# Altium project Control_Board_Model_C204.PrjPcb (part 2 of 2)

## Sheet Analog_Signal_Conditioner_V2.SchDoc: Analog Signal Conditioner
size A4; DocumentNumber: 6; SheetNumber: 6; SheetTotal: 51
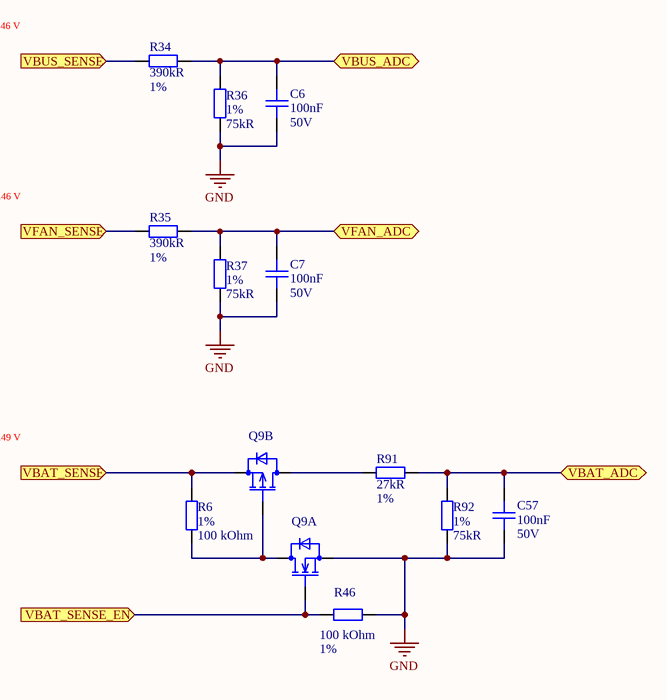
[diagram p5: Analog_Signal_Conditioner_V2.SchDoc]

### Parts
C6  Capacitance: 100nF  Voltage: 50V  [C0402]  (hidden comment: CAP CER 0.1UF 50V X7R 0402)
C7  Capacitance: 100nF  Voltage: 50V  [C0402]  (hidden comment: CAP CER 0.1UF 50V X7R 0402)
C57  Capacitance: 100nF  Voltage: 50V  [C0402]  (hidden comment: CAP CER 0.1UF 50V X7R 0402)
Q9  EM6M2T2R  [SON_400UV-7_DIO]  (value not drawn)  (parts A,B of 2)
R6  Tolerance: 1%  Resistance: 100 kOhm  [R0402]  (hidden comment: RES SMD 100K OHM 1% 1/16W 0402)
R34  Resistance: 390kR  Tolerance: 1%  [R0402]  (hidden comment: RES SMD 390K OHM 1% 1/16W 0402)
R35  Resistance: 390kR  Tolerance: 1%  [R0402]  (hidden comment: RES SMD 390K OHM 1% 1/16W 0402)
R36  Tolerance: 1%  Resistance: 75kR  [R0402]  (hidden comment: RES SMD 75K OHM 1% 1/16W 0402)
R37  Tolerance: 1%  Resistance: 75kR  [R0402]  (hidden comment: RES SMD 75K OHM 1% 1/16W 0402)
R46  Tolerance: 1%  Resistance: 100 kOhm  [R0402]  (hidden comment: RES SMD 100K OHM 1% 1/16W 0402)
R91  Resistance: 27kR  Tolerance: 1%  [R0402]  (hidden comment: RES SMD 27K OHM 1% 1/16W 0402)
R92  Tolerance: 1%  Resistance: 75kR  [R0402]  (hidden comment: RES SMD 75K OHM 1% 1/16W 0402)

### Ports
VBAT_ADC (bidir), VBAT_SENSE (in), VBAT_SENSE_EN (in), VBUS_ADC (bidir), VBUS_SENSE (in), VFAN_ADC (bidir), VFAN_SENSE (in)

### Nets
GND: C6.1 C7.1 C57.1 Q9.1(S) R36.1 R37.1 R46.1 R92.1
NetC6_2: C6.2 R34.2 R36.2 ; port VBUS_ADC
NetC7_2: C7.2 R35.2 R37.2 ; port VFAN_ADC
NetC57_2: C57.2 R91.2 R92.2 ; port VBAT_ADC
NetQ9_2: Q9.2(G) R46.2 ; port VBAT_SENSE_EN
NetQ9_3: Q9.3(D) R91.1
NetQ9_4: Q9.4(S) R6.2 ; port VBAT_SENSE
NetQ9_5: Q9.5(G) Q9.6(D) R6.1
NetR34_1: R34.1 ; port VBUS_SENSE
NetR35_1: R35.1 ; port VFAN_SENSE

### Notes on the sheet
- (near R34) VBUS_SENSE max = 20.46 V
- (near R35) VFAN_SENSE max = 20.46 V
- VBAT_SENSE max = 4.49 V
- Title
- Size:
- Date:
- A4
- Number:
- Time:
- Revision:
- Sheet
- of
- File:

### Library data of the parts
C6 C7 C57 = CAP CER 0.1UF 50V X7R 0402: 0.1µF ±10% 50V Ceramic Capacitor X7R 0402 (1005 Metric); Manufacturer Part Number: CGA2B3X7R1H104K050BB; Manufacturer: TDK; Supplier 1: Digi-Key; Stock 1: 2925303; Pricing 1: 1=0.17, 10=0.118, 50=0.0668, 100=0.0553, 500=0.0388, 1000=0.0321, 2500=0.0299, 5000=0.0273 (USD); Mount: Surface Mount; Case Code (Metric): 1005; Case Code (Imperial): 0402; Min Operating Temperature: -55°C; Max Operating Temperature: 125°C; Tolerance: 10%; Dielectric: X7R; Voltage Rating: 50V; Voltage Rating (DC): 50V; Packaging: Tape and Reel; Package Quantity: 1; Termination: SMD/SMT; Composition: Ceramic; Length: 1mm; Height: 0.5mm; Width: 0.02inch; Thickness: 0.022inch; Depth: 0.5mm; REACH SVHC: No SVHC; Lead Free: Lead Free; ComponentLink1URL: http://product.tdk.com/capacitor/mlcc/en/documents/mlccspec_automotive_general_midvoltage_en.pdf?src-supplier=Future+Electronics; ComponentLink1Description: http://product.tdk.com/capacitor/mlcc/en/documents/mlccspec_automotive_general_midvoltage_en.pdf?src-supplier=Future+Electronics; ComponentLink2URL: http://www.farnell.com/datasheets/1807242.pdf?src-supplier=Element14; ComponentLink2Description: http://www.farnell.com/datasheets/1807242.pdf?src-supplier=Element14; ComponentLink3URL: http://www.mouser.com/ds/2/400/lcc_automotive_general_en-843974.pdf?src-supplier=Mouser; ComponentLink3Description: http://www.mouser.com/ds/2/400/lcc_automotive_general_en-843974.pdf?src-supplier=Mouser; ComponentLink4URL: http://www.farnell.com/datasheets/1936565.pdf?src-supplier=Element14; ComponentLink4Description: http://www.farnell.com/datasheets/1936565.pdf?src-supplier=Element14; ComponentLink5URL: http://www.farnell.com/datasheets/1735392.pdf?src-supplier=Element14; ComponentLink5Description: http://www.farnell.com/datasheets/1735392.pdf?src-supplier=Element14; Supplier Part Number 1: 445-6899-1-ND; Case/Package: 0402; Weight: 2.3E-05oz; Ratings: AEC-Q200; ClassName: STM32G473CETx
Q9 = ARRAY MOSFET N/P-CH 20V 0.2A EMT6: Mosfet Array N and P-Channel 20V 200mA 150mW Surface Mount EMT6; Manufacturer: Rohm; Rds On Max: 1R; Input Capacitance: 25pF; Supplier 1: Digi-Key; Manufacturer Part Number: EM6M2T2R; Stock 1: 84378; Pricing 1: 1=0.44, 10=0.375, 25=0.35, 100=0.26, 250=0.247, 500=0.203, 1000=0.165, 2500=0.155 (USD); Mount: Surface Mount; Case/Package: SOT-23-5; Number of Pins: 6; Min Operating Temperature: -55°C; Max Operating Temperature: 150°C; Packaging: Tape and Reel; Package Quantity: 1; Drain to Source Voltage (Vdss): 20V; Continuous Drain Current (ID): 200mA; Max Power Dissipation: 150mW; Drain to Source Resistance: 1R; FET Type: N and P-Channel; Radiation Hardening: No; Lead Free: Lead Free; ComponentLink1URL: http://rohmfs.rohm.com/en/techdata_basic/transistor/taping/EMT6_T2R_taping.pdf?src-supplier=Digi-Key; ComponentLink1Description: http://rohmfs.rohm.com/en/techdata_basic/transistor/taping/EMT6_T2R_taping.pdf?src-supplier=Digi-Key; Supplier Part Number 1: EM6M2T2RCT-ND; ClassName: STM32G473CETx
R6 R46 = RES SMD 100K OHM 1% 1/16W 0402: 100 kOhms ±1% 0.063W, 1/16W Chip Resistor 0402 (1005 Metric) Moisture Resistant Thick Film; Manufacturer: Yageo; Manufacturer Part Number: RC0402FR-07100KL; Temperature Coefficient: 100ppm/°C; Power Rating: 63mW; Voltage Rating: 50V; Supplier 1: Digi-Key; Stock 1: 47448883; Pricing 1: 1=0.1, 10=0.016, 100=0.0064, 1000=0.0029, 2500=0.0025, 5000=0.0021 (USD); Case Code (Metric): 1005; Case Code (Imperial): 0402; Min Operating Temperature: -55°C; Max Operating Temperature: 155°C; Composition: Thick Film; Packaging: Tape and Reel; Package Quantity: 1; Number of Terminations: 2; Termination: SMD/SMT; Military Standard: Not; Max Power Dissipation: 63mW; Working Voltage: 50V; Features: Moisture Resistant; Length: 0.039inch; Height: 0.016inch; Width: 0.02inch; Depth: 0.5mm; REACH SVHC: No SVHC; Lead Free: Lead Free; ComponentLink1URL: http://www.yageo.com/documents/recent/PYu-RC_Group_51_RoHS_L_10.pdf?src-supplier=Digi-Key; ComponentLink1Description: http://www.yageo.com/documents/recent/PYu-RC_Group_51_RoHS_L_10.pdf?src-supplier=Digi-Key; ComponentLink2URL: http://www.farnell.com/datasheets/1018594.pdf?src-supplier=Element14; ComponentLink2Description: http://www.farnell.com/datasheets/1018594.pdf?src-supplier=Element14; ComponentLink3URL: http://www.yageo.com/documents/recent/PYu-RC_Group_51_RoHS_L_9.pdf?src-supplier=Verical; ComponentLink3Description: http://www.yageo.com/documents/recent/PYu-RC_Group_51_RoHS_L_9.pdf?src-supplier=Verical; ComponentLink4URL: http://www.yageo.com/documents/recent/PYu-RC_Group_51_RoHS_L_9.pdf?src-supplier=Mouser; ComponentLink4Description: http://www.yageo.com/documents/recent/PYu-RC_Group_51_RoHS_L_9.pdf?src-supplier=Mouser; ComponentLink5URL: http://documents.rs-components.com/techlib://itc_doclist_GB.htm?stockno=6185797&src-supplier=RSComponents; ComponentLink5Description: http://documents.rs-components.com/techlib://itc_doclist_GB.htm?stockno=6185797&src-supplier=RSComponents; Supplier Part Number 1: 311-100KLRDKR-ND; Case/Package: 0402; ClassName: STM32G473CETx; Mount: Surface Mount
R34 R35 = RES SMD 390K OHM 1% 1/16W 0402: 390 kOhms ±1% 0.063W, 1/16W Chip Resistor 0402 (1005 Metric) Moisture Resistant Thick Film; Manufacturer: Yageo; Manufacturer Part Number: RC0402FR-07390KL; Power Rating: 62.5mW; Voltage Rating: 50V; Temperature Coefficient: 100ppm/°C; Max Power Dissipation: 63mW; Supplier 1: Digi-Key; Stock 1: 118017; Pricing 1: 1=0.1, 10=0.016, 100=0.0064, 1000=0.0029, 2500=0.0025, 5000=0.0021 (USD); Case/Package: 0402; Weight: 2.3E-05oz; Case Code (Imperial): 0402; Case Code (Metric): 1005; Min Operating Temperature: -55°C; Max Operating Temperature: 155°C; Packaging: Tape and Reel; Composition: Thick Film; Number of Terminations: 2; Termination: SMD/SMT; Military Standard: Not; Features: Moisture Resistant; Length: 1mm; Height: 0.016inch; Width: 0.02inch; Depth: 0.5mm; REACH SVHC: Unknown; Lead Free: Lead Free; ComponentLink1URL: http://www.yageo.com/documents/recent/PYu-RC0402_51_RoHS_L_6.pdf?src-supplier=Future+Electronics; ComponentLink1Description: http://www.yageo.com/documents/recent/PYu-RC0402_51_RoHS_L_6.pdf?src-supplier=Future+Electronics; ComponentLink2URL: http://www.farnell.com/datasheets/2167052.pdf?src-supplier=Element14; ComponentLink2Description: http://www.farnell.com/datasheets/2167052.pdf?src-supplier=Element14; ComponentLink3URL: http://www.mouser.com/ds/2/447/PYu-RC0402_51_RoHS_L_6_r-8721.pdf?src-supplier=Mouser; ComponentLink3Description: http://www.mouser.com/ds/2/447/PYu-RC0402_51_RoHS_L_6_r-8721.pdf?src-supplier=Mouser; Supplier Part Number 1: YAG3143CT-ND; ClassName: STM32G473CETx; Mount: Surface Mount
R36 R37 R92 = RES SMD 75K OHM 1% 1/16W 0402: 75 kOhms ±1% 0.063W, 1/16W Chip Resistor 0402 (1005 Metric) Automotive AEC-Q200 Thick Film; Manufacturer: Stackpole Electronics; Manufacturer Part Number: RMCF0402FT75K0; Power Rating: 63mW; Temperature Coefficient: 100ppm/°C; Supplier 1: Digi-Key; Stock 1: 24693; Pricing 1: 1=0.1, 10=0.014, 100=0.0058, 1000=0.0026, 2500=0.0023, 5000=0.0019 (USD); Mount: Surface Mount; Case/Package: 0402; Case Code (Metric): 1005; Case Code (Imperial): 0402; Contact Plating: Tin,Matte; Min Operating Temperature: -55°C; Max Operating Temperature: 155°C; Features: Automotive AEC-Q200; Packaging: Tape and Reel; Composition: Thick Film; Number of Terminations: 2; Military Standard: Not; Max Power Dissipation: 63mW; Length: 0.039inch; Height: 0.016inch; Width: 0.02inch; Depth: 0.5mm; Radiation Hardening: No; Lead Free: Lead Free; ComponentLink1URL: https://www.seielect.com/catalog/SEI-Packaging.pdf?src-supplier=Digi-Key; ComponentLink1Description: https://www.seielect.com/catalog/SEI-Packaging.pdf?src-supplier=Digi-Key; ComponentLink2URL: http://www.seielect.com/Catalog/Sei-RMC.pdf?src-supplier=Future+Electronics; ComponentLink2Description: http://www.seielect.com/Catalog/Sei-RMC.pdf?src-supplier=Future+Electronics; ComponentLink3URL: https://www.seielect.com/catalog/SEI-RMCF_RMCP.pdf?src-supplier=Avnet; ComponentLink3Description: https://www.seielect.com/catalog/SEI-RMCF_RMCP.pdf?src-supplier=Avnet; ComponentLink4URL: http://components.arrow.com/part/dataview/47811039S7743759N1174?src-supplier=Arrow; ComponentLink4Description: http://components.arrow.com/part/dataview/47811039S7743759N1174?src-supplier=Arrow; ComponentLink5URL: https://www.verical.com/server-webapp/html/getDatasheet?partID=492569&src-supplier=Verical; ComponentLink5Description: https://www.verical.com/server-webapp/html/getDatasheet?partID=492569&src-supplier=Verical; Supplier Part Number 1: RMCF0402FT75K0CT-ND; ClassName: STM32G473CETx
R91 = RES SMD 27K OHM 1% 1/16W 0402: 27 kOhms ±1% 0.063W, 1/16W Chip Resistor 0402 (1005 Metric) Moisture Resistant Thick Film; Manufacturer: Yageo; Manufacturer Part Number: RC0402FR-0727KL; Power Rating: 63mW; Voltage Rating: 50V; Temperature Coefficient: 100ppm/°C; Supplier 1: Digi-Key; Stock 1: 1508379; Pricing 1: 1=0.1, 10=0.016, 100=0.0064, 1000=0.0029, 2500=0.0025, 5000=0.0021 (USD); Case/Package: 0402; Case Code (Imperial): 0402; Case Code (Metric): 1005; Min Operating Temperature: -55°C; Max Operating Temperature: 155°C; Packaging: Tape and Reel; Composition: Thick Film; Number of Terminations: 2; Termination: SMD/SMT; Military Standard: Not; Max Power Dissipation: 63mW; Features: Moisture Resistant; Length: 1mm; Height: 0.016inch; Width: 0.02inch; Depth: 0.5mm; Lead Free: Lead Free; ComponentLink1URL: http://www.farnell.com/datasheets/2167052.pdf?src-supplier=Element14; ComponentLink1Description: http://www.farnell.com/datasheets/2167052.pdf?src-supplier=Element14; ComponentLink2URL: http://documents.rs-components.com/techlib://itc_doclist_GB.htm?stockno=6186475&src-supplier=RSComponents; ComponentLink2Description: http://documents.rs-components.com/techlib://itc_doclist_GB.htm?stockno=6186475&src-supplier=RSComponents; ComponentLink3URL: http://www.yageo.com/documents/recent/PYu-RC_Group_51_RoHS_L_10.pdf?src-supplier=Digi-Key; ComponentLink3Description: http://www.yageo.com/documents/recent/PYu-RC_Group_51_RoHS_L_10.pdf?src-supplier=Digi-Key; Supplier Part Number 1: 311-27.0KLRCT-ND; ComponentLink4URL: http://www.yageo.com/documents/recent/PYu-RC0402_51_RoHS_L_6_r.pdf?src-supplier=Future+Electronics; ComponentLink4Description: http://www.yageo.com/documents/recent/PYu-RC0402_51_RoHS_L_6_r.pdf?src-supplier=Future+Electronics; Package Quantity: 10000; REACH SVHC: Unknown; ClassName: STM32G473CETx; Mount: Surface Mount

## Nets that join several sheets
+1V8: Sensor Connection (R47.2 R48.2), Test_Points (TP9.1)
+3V3: USB_Type-C_Port_V2.0 (NT1.1), Test_Points (TP10.1)
+3V3_AUX: Sensor Connection (8 pins), BMI270_IMU (NT6.2), Test_Points (TP8.1)
GND: USB_Type-C_Port_V2.0 (19 pins), Sensor Connection (15 pins), BMI270_IMU (NT7.2), Audio_Module (NT4.1 NT5.1), Test_Points (6 pins), Analog_Signal_Conditioner_V2 (8 pins)
VBUS: USB_Type-C_Port_V2.0 (6 pins), Test_Points (TP12.1)

## Assembly variants
DNP_Version: not fitted C39 C40 C113 C114 C120 P1 R23 R26 R66 R67 R96 R169